# EasyEDA Pro project 复活吧！我们的平衡车！.eprj

# Schematic Schematic1
Board Name: Board1; Create Date: 2025-03-22; Page Name: P1; Project Name: 复活吧！我们的平衡车！; Schematic Name: Schematic1; Update Date: 2025-03-22; Company: 嘉立创EDA; Page Size: A4; Version: V1.0
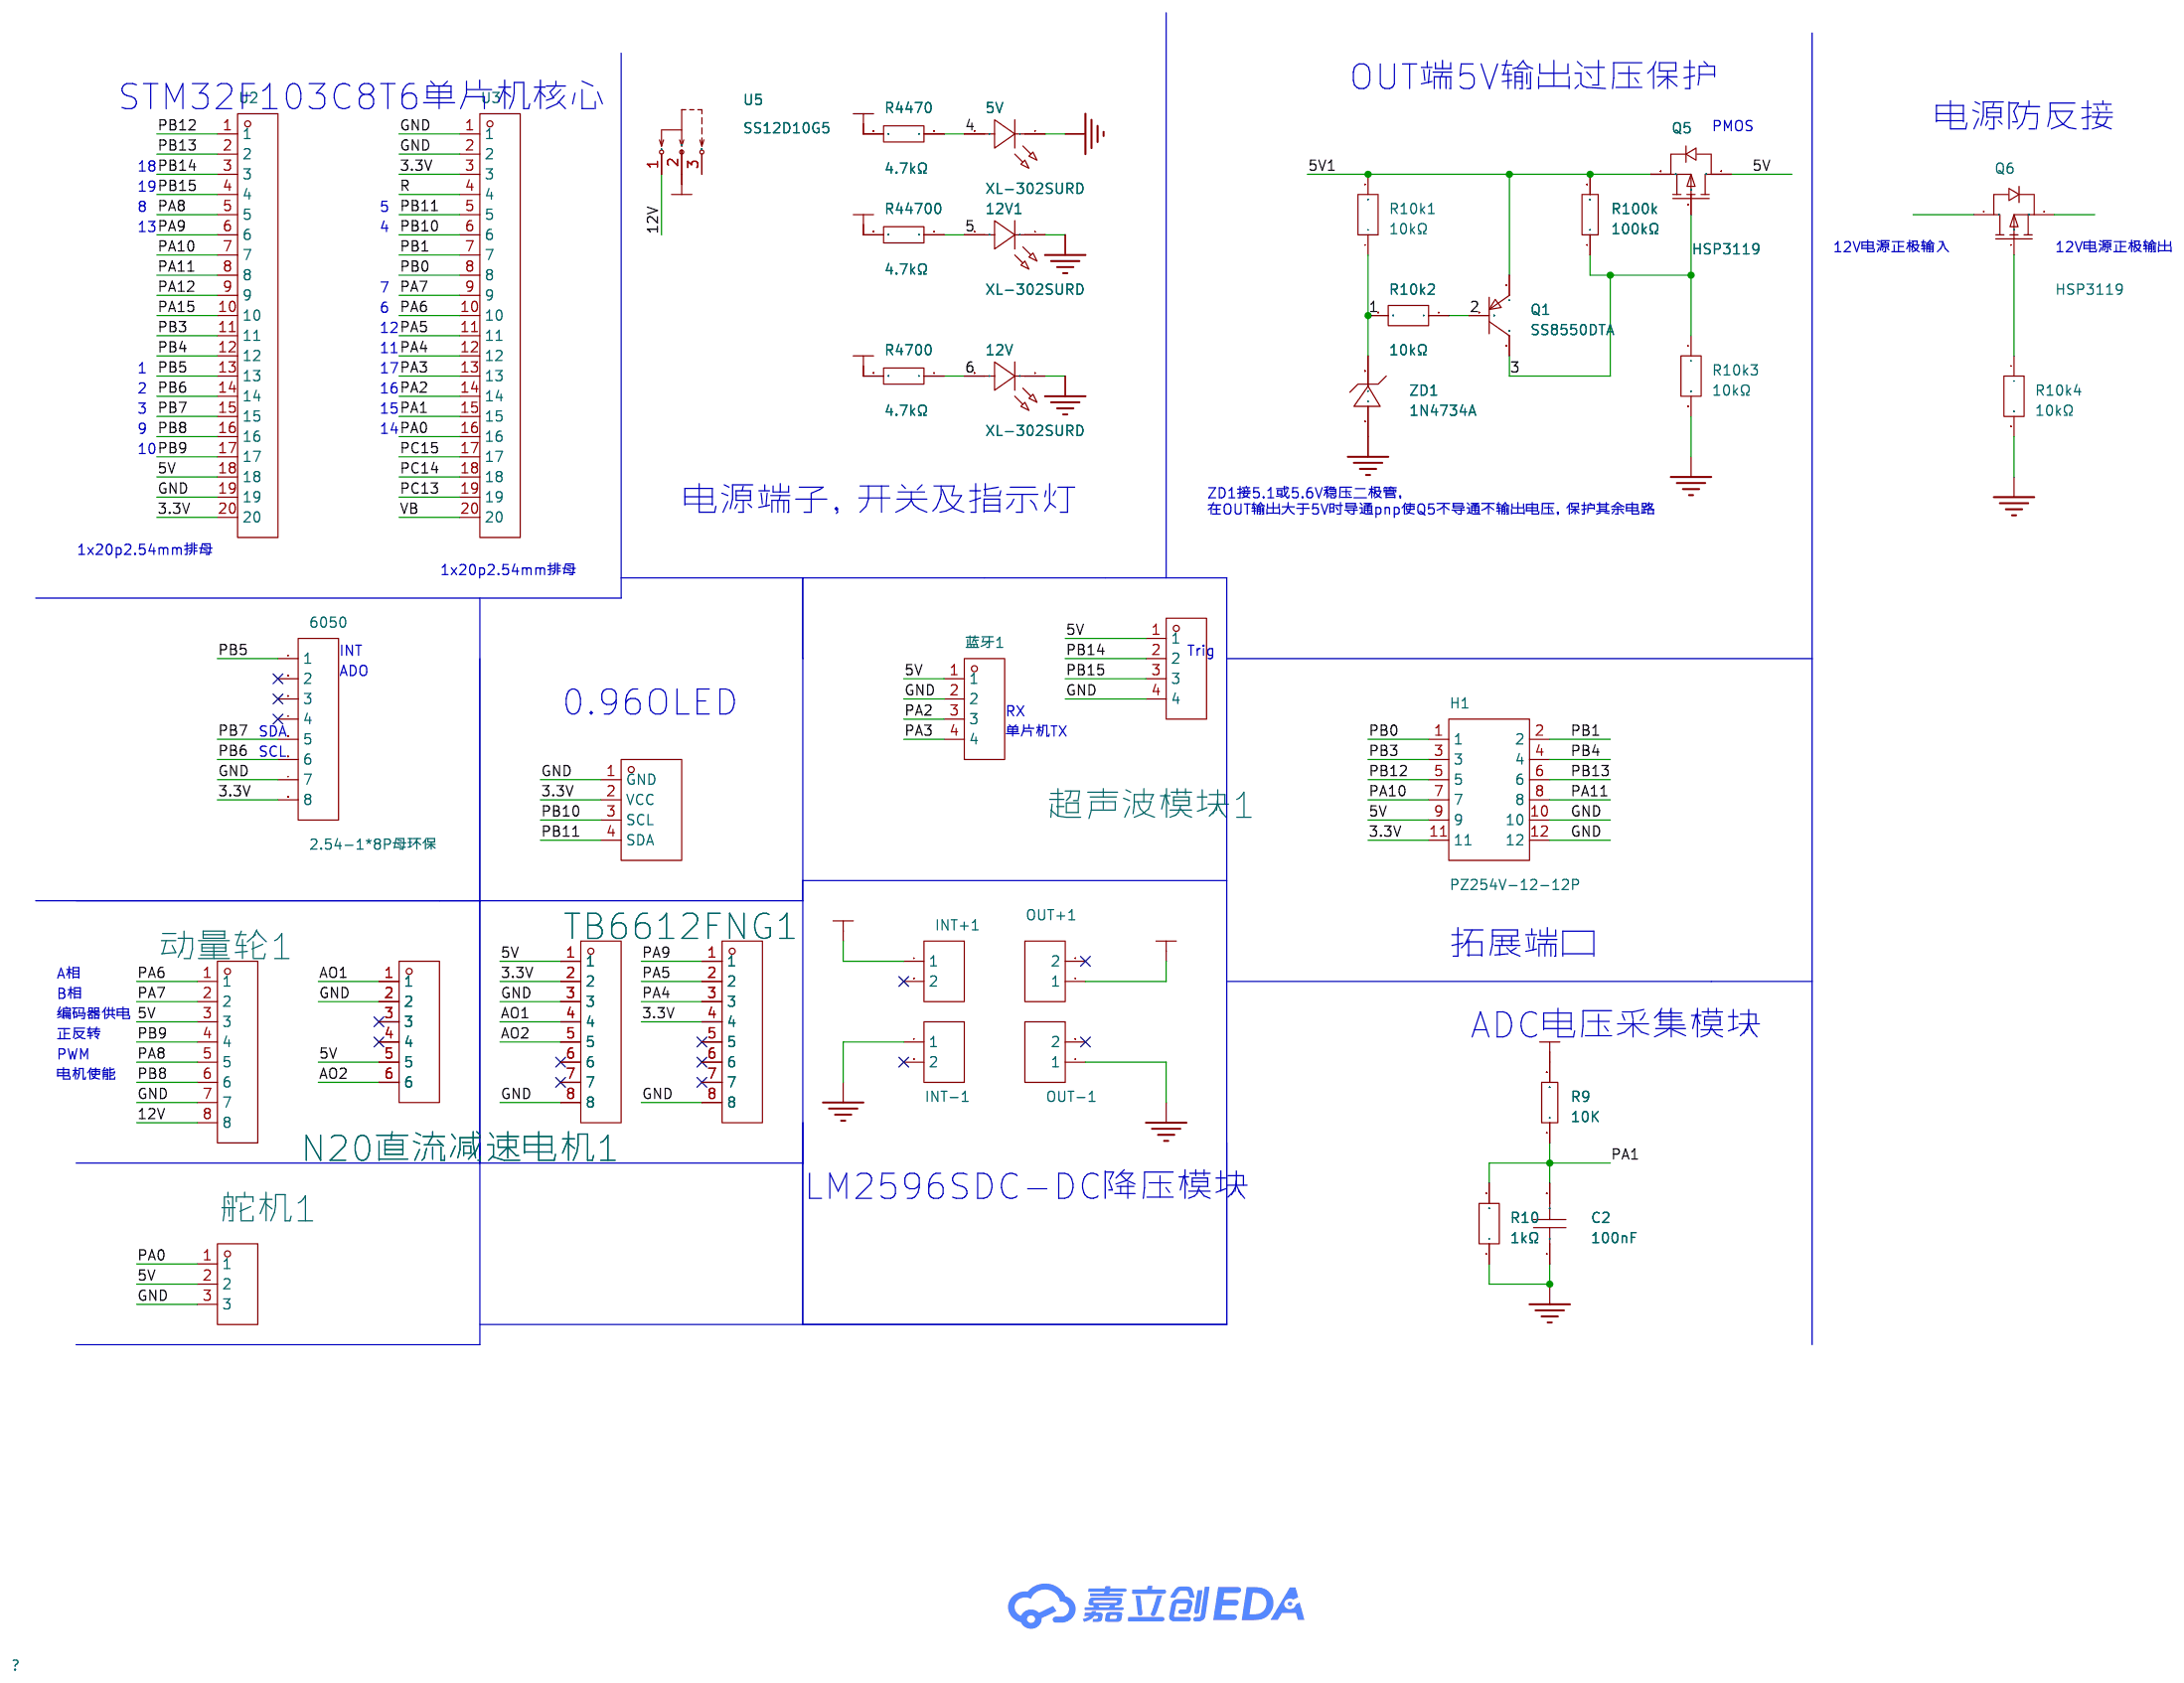
[diagram p0: schematic sheet]

## Parts
5V  XL-302SURD  [LED-TH_BD3.8-P2.54-RD]
12V  XL-302SURD  [LED-TH_BD3.8-P2.54-RD]
12V1  XL-302SURD  [LED-TH_BD3.8-P2.54-RD]
6050  2.54-1*8P母环保  [HDR-TH_8P-P2.54-V-F-1]
C2  100nF  [rad-0.1]
H1  PZ254V-12-12P  [HDR-TH_12P-P2.54-V-M-R2-C6-S2.54]
INT+1  2.54-1*2P母  [HDR-TH_2P-P2.54-V-F]
INT-1  2.54-1*2P母  [HDR-TH_2P-P2.54-V-F]
N20直流减速电机1  KH-2PH90-1X6P-L10.5  [hdr-th_6p-p2.54-v-f]
OLED1  HS96L03W2C03  [OLED-TH_L27.8-W27.2-P2.54_C9900033791]
OUT+1  2.54-1*2P母  [HDR-TH_2P-P2.54-V-F]
OUT-1  2.54-1*2P母  [HDR-TH_2P-P2.54-V-F]
Q1  SS8550DTA  [TO-92-3_L4.8-W3.7-P2.54-L]
Q5  HSP3119  [TO-220-3_L10.2-W4.5-P2.54-L-1]
Q6  HSP3119  [TO-220-3_L10.2-W4.5-P2.54-L-1]
R9  10K  [RES-TH_BD2.3-L6.5-P10.50-D0.5]
R10  1kΩ  [RES-TH_BD2.3-L6.5-P10.50-D0.5]
R10k1  10kΩ  [RES-TH_BD2.4-L6.3-P10.30-D0.6]
R10k2  10kΩ  [RES-TH_BD2.4-L6.3-P10.30-D0.6]
R10k3  10kΩ  [RES-TH_BD2.4-L6.3-P10.30-D0.6]
R10k4  10kΩ  [RES-TH_BD2.4-L6.3-P10.30-D0.6]
R100k  100kΩ  [RES-TH_BD2.7-L6.2-P10.20-D0.4]
R4470  4.7kΩ  [RES-TH_BD2.3-L6.5-P10.50-D0.5]
R4700  4.7kΩ  [RES-TH_BD2.3-L6.5-P10.50-D0.5]
R44700  4.7kΩ  [RES-TH_BD2.3-L6.5-P10.50-D0.5]
TB1  2.54-1*8P/30mm(3+24+3)  [hdr-th_8p-p2.54-v-f]
TB6612FNG1  2.54-1*8P/30mm(3+24+3)  [HDR-TH_8P-P2.54-V-M-4]
U2  KH-2FH-1X20P-H4.3  [hdr-th_20p-p2.54-v-f]
U3  KH-2FH-1X20P-H4.3  [hdr-th_20p-p2.54-v-f]
U5  SS12D10G5  [SW-TH_SHOU-HAN_SS12D10G4]
ZD1  1N4734A  [DO-41_BD2.8-L4.2-P8.00-D0.7-FD]
动量轮1  2.54-1*8P/30mm(3+24+3)  [hdr-th_8p-p2.54-v-f]
舵机1  PM254V-11-03-H85  [HDR-TH_3P-P2.54-V-F]
蓝牙1  2.54-1*4P母
超声波模块1  KH-2.54FH-1X4P-H8.5

## Library data of the parts
5V 12V 12V1 = XL-302SURD: 灯头类型:3mm圆形灯头;发光颜色:红色;功率:80mW;正向电流:30mA;主波长:615nm~620nm;透镜颜色:红色透镜;色温:-;发光角度:50°;载带方式:-;工作温度:-25℃~+85℃;; Supplier Part: C2895470; Manufacturer: XINGLIGHT(成兴光); Supplier Footprint: 插件,D=3mm; JLCPCB Part Class: 扩展库; Datasheet: https://atta.szlcsc.com/upload/public/pdf/source/20240112/E1E2B82945FD635E4907401DDE6D4922.pdf; Supplier: LCSC; Lamp Holder Type: 3mm圆形灯头; Emitted Color: 红色; Power Dissipation: 80mW; Forward Current: 30mA; Dominant Wavelength: 615nm~620nm; Peak Wavelength: 625nm; Lens Color: 红色透镜; Viewing Angle: 50°; Operating Temperature: -25℃~+85℃
6050 = 2.54-1*8P母环保: 插孔结构:1x8P;间距:2.54mm;行距:-;安装类型:直插;排数:单排;总孔位数:8P;塑高:-;触头材质:-;触头镀层:-;; LCSC Part Name: 间距:2.54mm 1x8P 直插; Supplier Part: C27438; Manufacturer: BOOMELE(博穆精密); Supplier Footprint: 插件,P=2.54mm; JLCPCB Part Class: 扩展库; Datasheet: https://atta.szlcsc.com/upload/public/pdf/source/20231221/1CA800C6799ED97958773716FAA1BFFE.pdf; Supplier: LCSC; Holes Structure: 1x8P; Pitch: 2.54mm; Mounting Type: 直插; Number of Rows: 单排; Number of Holes: 8P
C2 = CAP_0603: Supplier Footprint: 0603
H1 = PZ254V-12-12P: 插针结构:2x6P;间距:2.54mm;行距:2.54mm;圆针/方针:方针;安装方式:直插;排数:双排;总PIN位数:12P;额定电流:-;额定电压:-;配合针长度:6mm;塑高:2.5mm;端接针长度:3mm;触头材质:黄铜;触头镀层:-;工作温度:-40℃~+105℃;颜色:黑色;; LCSC Part Name: 2x6P 间距:2.54mm 方针 直插; Supplier Part: C492423; Manufacturer: XFCN(兴飞); Supplier Footprint: 插件,P=2.54mm; JLCPCB Part Class: 扩展库; Datasheet: https://atta.szlcsc.com/upload/public/pdf/source/20200309/C492423_E4E2C9BC0EB9D59A2ABE4377D2E234B2.pdf; Supplier: LCSC; Pin Structure: 2x6P; Pitch: 2.54mm; Row Spacing: 2.54mm; Circluar Pins/Square Pins: 方针; Mounting Type: 直插; Number of Rows: 双排; Number of Pins: 12P; Length of Mating Pin: 6mm; Insulation Height: 2.5mm; Length of End Connection Pin: 3mm; Contact Material: 黄铜; Operating Temperature: -40℃~+105℃; Color: 黑色
INT+1 INT-1 OUT+1 OUT-1 = 2.54-1*2P母: 插孔结构:1x2P;间距:2.54mm;行距:-;安装类型:直插;排数:单排;总孔位数:2P;塑高:-;触头材质:-;触头镀层:-;; LCSC Part Name: 间距:2.54mm 1x2P 直插; Supplier Part: C49661; Manufacturer: BOOMELE(博穆精密); Supplier Footprint: 插件,P=2.54mm; JLCPCB Part Class: 扩展库; Datasheet: https://atta.szlcsc.com/upload/public/pdf/source/20210301/C2718488_F4427B881E42CAA8DDB0B1C12B3A522C.pdf; Supplier: LCSC; Holes Structure: 1x2P; Pitch: 2.54mm; Mounting Type: 直插; Number of Rows: 单排; Number of Holes: 2P
N20直流减速电机1 = KH-2PH90-1X6P-L10.5: 插针结构:1x6P;间距:2mm;行距:-;圆针/方针:方针;安装类型:弯插;排数:单排;总PIN位数:6P;额定电流:1.5A;额定电压:-;配合针长度:4mm;塑高:2mm;端接针长度:-;工作温度范围:-40℃~+105℃;颜色:-;; LCSC Part Name: 间距:2mm 1x6P 弯插 方针; Supplier Part: C2938467; Manufacturer: kinghelm(金航标); Supplier Footprint: 弯插,P=2mm; JLCPCB Part Class: 扩展库; Datasheet: https://atta.szlcsc.com/upload/public/pdf/source/20211228/823CD8A7BB037D772766BAFF43582E23.pdf; Supplier: LCSC; Pin Structure: 1x6P; Pitch: 2mm; Circluar Pins/Square Pins: 方针; Mounting Type: 弯插; Number of Rows: 单排; Number of Pins: 6P; Current Rating (Max): 1.5A; Length of Mating Pin: 4mm; Insulation Height: 2mm; Operating Temperature Range: -40℃~+105℃
OLED1 = HS96L03W2C03: 主控芯片:SSD1315;接口类型:I2C;尺寸(inch):0.96;像素分辨率:128x64;; LCSC Part Name: 0.96寸OLED显示屏窄白光IIC; Supplier Part: C5248080; Manufacturer: HS(汉昇); JLCPCB Part Class: 扩展库; Datasheet: https://atta.szlcsc.com/upload/public/pdf/source/20230627/763D01F79A90007632F098068C7C8AD9.pdf; Supplier: LCSC; Main Control Chip: SSD1315; Interface Type: I2C; Size: 0.96; Pixel Resolution: 128x64; Operating Temperature: -40℃~+70℃
Q1 = SS8550DTA: 晶体管类型:PNP;集电极电流(Ic):1.5A;集射极击穿电压(Vceo):25V;功率(Pd):2W;直流电流增益(hFE@Ic,Vce):40@800mA,1V;; LCSC Part Name: PNP 电流:1.5A 耐压:25V; Supplier Part: C903228; Manufacturer: onsemi(安森美); Supplier Footprint: TO-92-3; JLCPCB Part Class: Extended Part; Datasheet: https://atta.szlcsc.com/upload/public/pdf/source/20221020/9DBCD1C6A257D06DE4F9043ED0140297.pdf; Supplier: LCSC; Transistor Type: PNP; Collector Current (Ic): 1.5A; Collector-Emitter Breakdown Voltage (Vceo): 25V; Power Dissipation (Pd): 2W; DC Current Gain (hFE@Ic,Vce): 40@800mA,1V; Transition Frequency (fT): 100MHz; Collector Cut-Off Current (Icbo): 100nA; Collector-Emitter Saturation Voltage (VCE(sat)@Ic,Ib): 280mV@800mA,80mA; Operating Temperature: -65℃~+150℃
Q5 Q6 = HSP3119: 类型:1个P沟道;漏源电压(Vdss):30V;连续漏极电流(Id):150A;导通电阻(RDS(on)):-;耗散功率(Pd):200W;阈值电压(Vgs(th)):2.5V;; LCSC Part Name: 1个P沟道 耐压:30V 电流:150A; Supplier Part: C22359262; Manufacturer: HUASHUO(华朔); Supplier Footprint: TO-220; JLCPCB Part Class: Extended Part; Datasheet: https://atta.szlcsc.com/upload/public/pdf/source/20240313/B2043F85A28365E5AF5F107A9C9B0F2E.pdf; Supplier: LCSC; Type: 1个P沟道; Drain to Source Voltage: 30V; Current - Continuous Drain(Id): 150A; Pd - Power Dissipation: 200W; Gate Threshold Voltage (Vgs(th)@Id): 2.5V; Input Capacitance(Ciss@Vds): 12.7nF@15V; Reverse Transfer Capacitance (Crss@Vds): 1.21nF@15V; Operating Temperature: -55℃~+150℃@(Tj)
R9 = Res_0603: Supplier Footprint: 0603
R10 = MF1/4W-1KΩ±1%T52: 电阻类型:金属膜电阻;阻值:1kΩ;精度:±1%;功率:250mW;温度系数:±200ppm/℃;; LCSC Part Name: 金属膜电阻 1kΩ ±1% 250mW; Supplier Part: C713997; Manufacturer: 华星机电; Supplier Footprint: 插件; JLCPCB Part Class: 扩展库; Datasheet: https://atta.szlcsc.com/upload/public/pdf/source/20200731/C713882_AE8EB1102749D7E4FB4FB13DC898C429.pdf; Supplier: LCSC; Type: 金属膜电阻; Tolerance: ±1%; Power(Watts): 250mW; Temperature Coefficient: ±200ppm/℃
R10k1-R10k4 = RN1/4W10KFT/BA1: 电阻类型:金属膜电阻;阻值:10kΩ;精度:±1%;功率:250mW;温度系数:±50ppm/℃;; LCSC Part Name: 10kΩ ±1% 250mW 金属膜电阻; Supplier Part: C410695; Manufacturer: Tyohm(幸亚电阻); Supplier Footprint: 插件,D2.4xL6.5mm; JLCPCB Part Class: Extended Part; Datasheet: https://atta.szlcsc.com/upload/public/pdf/source/20190808/C410699_D126E64D28B638F1D73B58E9F61DFD9B.pdf; Supplier: LCSC; Type: 金属膜电阻; Tolerance: ±1%; Overload Voltage (Max): 250V; Power(Watts): 250mW; Temperature Coefficient: ±50ppm/℃; Operating Temperature Range: -55℃~+125℃
R100k = MF1/4W-100K±1%-OT26: 电阻类型:金属膜电阻;阻值:100kΩ;精度:±1%;功率:250mW;温度系数:±350ppm/℃;; LCSC Part Name: 金属膜电阻 100kΩ ±1% 250mW; Supplier Part: C2843019; Manufacturer: VO(翔胜); Supplier Footprint: 插件,D2.7xL6.2mm; JLCPCB Part Class: Extended Part; Datasheet: https://atta.szlcsc.com/upload/public/pdf/source/20200609/C601728_5AA4C0C8E12E11069DA2C3356F29D1F2.pdf; Supplier: LCSC; Type: 金属膜电阻; Tolerance: ±1%; Overload Voltage (Max): 250V; Power(Watts): 250mW; Temperature Coefficient: ±350ppm/℃; Operating Temperature Range: -55℃~+155℃
R4470 R4700 R44700 = 0402WGF4701TCE: 电阻类型:厚膜电阻;阻值:4.7kΩ;精度:±1%;功率:62.5mW;最大工作电压:50V;温度系数:±100ppm/℃;; LCSC Part Name: 4.7kΩ ±1% 62.5mW 厚膜电阻; Supplier Part: C25900; Manufacturer: UNI-ROYAL(厚声); Supplier Footprint: 0402; JLCPCB Part Class: 基础库; Datasheet: https://atta.szlcsc.com/upload/public/pdf/source/20200306/C422600_1E6D84923E4A46A82E41ADD87F860B5C.pdf; Supplier: LCSC; Type: 厚膜电阻; Tolerance: ±1%; Power(Watts): 62.5mW; Overload Voltage (Max): 50V; Temperature Coefficient: ±100ppm/℃; Operating Temperature Range: -55℃~+155℃
TB1 TB6612FNG1 动量轮1 = 2.54-1*8P/30mm(3+24+3): Supplier Part: C9900034496; Supplier Footprint: 2.54-1x8; JLCPCB Part Class: 扩展库; Supplier: LCSC
U2 U3 = KH-2FH-1X20P-H4.3: 插孔结构:1x20P;间距:2mm;行距:-;圆孔/方孔:方孔;安装类型:直插;排数:单排;总孔位数:20P;额定电流:1.5A;额定电压:-;插孔方向:顶部;塑高:4.3mm;工作温度范围:-40℃~+105℃;; LCSC Part Name: 间距:2mm 1x20P 直插; Supplier Part: C2938439; Manufacturer: kinghelm(金航标); Supplier Footprint: 插件,P=2mm; JLCPCB Part Class: 扩展库; Datasheet: https://atta.szlcsc.com/upload/public/pdf/source/20211228/5EC70B7FC510D3D80A3799409C3607F1.pdf; Supplier: LCSC; Holes Structure: 1x20P; Pitch: 2mm; Circular Hole / Square Hole: 方孔; Mounting Type: 直插; Number of Rows: 单排; Number of Holes: 20P; Current Rating (Max): 1.5A; Holes Direction: 顶部; Insulation Height: 4.3mm; Operating Temperature Range: -40℃~+105℃
U5 = SS12D10G5: 电路结构:单刀双掷;安装方式:直插;额定电流(DC):2A;额定电压(DC):125V;机械寿命:3千次;; LCSC Part Name: 两档立式插件 3脚拨动开关 柄长5.0mm; Supplier Part: C7431054; Manufacturer: SHOU HAN(首韩); Supplier Footprint: 插件; JLCPCB Part Class: 扩展库; Datasheet: https://atta.szlcsc.com/upload/public/pdf/source/20231130/7A3DB6A149BF0A1DCFFE64FFC07FE434.pdf; Supplier: LCSC; Circuit: 单刀双掷; Switch Length: 12.7mm; Switch Width: 6.7mm; Mounting Style: 直插; Current Rating (DC): 2A; Voltage Rating (DC): 125V; Mechanical Life: 3千次; Operating Temperature: -25℃~+70℃
ZD1 = 1N4734A_C41430: 二极管配置:独立式;稳压值(标称值):5.6V;耗散功率(Pd):-;; LCSC Part Name: 编带 1N4734A; Supplier Part: C41430; Manufacturer: ST(先科); Supplier Footprint: DO-41; JLCPCB Part Class: Extended Part; Datasheet: https://atta.szlcsc.com/upload/public/pdf/source/20170719/C118641_1500457766301828347.pdf; Supplier: LCSC; Diode Configuration: 独立式; Zener Voltage(Nom): 5.6V; Reverse Leakage Current (Ir): 10uA@2V; Impedance(Zzt): 5Ω
舵机1 = PM254V-11-03-H85: 插孔结构:1x3P;间距:2.54mm;行距:-;安装类型:直插;排数:单排;总孔位数:3P;塑高:-;触头材质:黄铜;触头镀层:-;; LCSC Part Name: 间距:2.54mm 1x3P 直插; Supplier Part: C541850; Manufacturer: XFCN(兴飞); Supplier Footprint: 插件,P=2.54mm; JLCPCB Part Class: 扩展库; Datasheet: https://atta.szlcsc.com/upload/public/pdf/source/20200518/C541849_85853D71FC67C51915A806977A588FDA.pdf; Supplier: LCSC; Holes Structure: 1x3P; Pitch: 2.54mm; Mounting Type: 直插; Number of Rows: 单排; Number of Holes: 3P; Contact Material: 黄铜
蓝牙1 = 2.54-1*4P母: 插孔结构:1x4P;间距:2.54mm;行距:-;圆孔/方孔:方孔;安装类型:直插;排数:单排;总孔位数:4P;额定电流:3A;额定电压:-;插孔方向:顶部;塑高:-;触头材质:青铜;触头镀层:-;工作温度范围:-40℃~+105℃;焊接温度(最大值):-;; LCSC Part Name: 间距:2.54mm 1x4P 直插; Supplier Part: C2718488; Manufacturer: BOOMELE(博穆精密); Supplier Footprint: 插件,P=2.54mm; JLCPCB Part Class: 扩展库; Datasheet: https://atta.szlcsc.com/upload/public/pdf/source/20210301/C2718488_F4427B881E42CAA8DDB0B1C12B3A522C.pdf; Supplier: LCSC; Holes Structure: 1x4P; Pitch: 2.54mm; Circular Hole / Square Hole: 方孔; Mounting Type: 直插; Number of Rows: 单排; Number of Holes: 4P; Current Rating (Max): 3A; Holes Direction: 顶部; Contact Material: 青铜; Operating Temperature Range: -40℃~+105℃
超声波模块1 = KH-2.54FH-1X4P-H8.5: 插孔结构:1x4P;间距:2.54mm;行距:-;圆孔/方孔:方孔;安装类型:直插;排数:单排;总孔位数:4P;额定电流:3A;额定电压:-;插孔方向:顶部;塑高:8.5mm;工作温度范围:-40℃~+105℃;; LCSC Part Name: 间距:2.54mm 1x4P 直插; Supplier Part: C2905415; Manufacturer: kinghelm(金航标); Supplier Footprint: 插件,P=2.54mm; JLCPCB Part Class: 扩展库; Datasheet: https://atta.szlcsc.com/upload/public/pdf/source/20211019/F01742C8B89DCA4810A857CC894DA6D1.pdf; Supplier: LCSC; Holes Structure: 1x4P; Pitch: 2.54mm; Circular Hole / Square Hole: 方孔; Mounting Type: 直插; Number of Rows: 单排; Number of Holes: 4P; Current Rating (Max): 3A; Holes Direction: 顶部; Insulation Height: 8.5mm; Operating Temperature Range: -40℃~+105℃

## Nets
3.3V: 6050.8 H1.11 OLED1.2(VCC) TB1.4 TB6612FNG1.2 U2.20 U3.3
5V: H1.9 N20直流减速电机1.5 Q5.2(D) R4470.2 TB6612FNG1.1 U2.18 动量轮1.3 舵机1.2 蓝牙1.1 超声波模块1.1
5V1: OUT+1.1 Q1.1(E) Q5.3(S) R10k1.2 R100k.2
12V: INT+1.1 R9.2 R4700.2 U5.1 动量轮1.8
12V1: R44700.2 U5.2
GND: 5V.1(K) 12V.1(K) 12V1.1(K) 6050.7 C2.1 H1.10 H1.12 INT-1.1 N20直流减速电机1.2 OLED1.1(GND) OUT-1.1 R10.1 R10k3.2 R10k4.2 TB1.8 TB6612FNG1.3 TB6612FNG1.8 U2.19 U3.1 U3.2 ZD1.1(A) 动量轮1.7 舵机1.3 蓝牙1.2 超声波模块1.4
1: R10k1.1 R10k2.2 ZD1.2(K)
2: Q1.2(B) R10k2.1
3: Q1.3(C) Q5.1(G) R10k3.1 R100k.1
4: 5V.2(A) R4470.1
5: 12V1.2(A) R44700.1
6: 12V.2(A) R4700.1
AO1: N20直流减速电机1.1 TB6612FNG1.4
AO2: N20直流减速电机1.6 TB6612FNG1.5
PA0: U3.16 舵机1.1
PA1: C2.2 R9.1 R10.2 U3.15
PA2: U3.14 蓝牙1.3
PA3: U3.13 蓝牙1.4
PA4: TB1.3 U3.12
PA5: TB1.2 U3.11
PA6: U3.10 动量轮1.1
PA7: U3.9 动量轮1.2
PA8: U2.5 动量轮1.5
PA9: TB1.1 U2.6
PA10: H1.7 U2.7
PA11: H1.8 U2.8
PA12: U2.9
PA15: U2.10
PB0: H1.1 U3.8
PB1: H1.2 U3.7
PB3: H1.3 U2.11
PB4: H1.4 U2.12
PB5: 6050.1 U2.13
PB6: 6050.6 U2.14
PB7: 6050.5 U2.15
PB8: U2.16 动量轮1.6
PB9: U2.17 动量轮1.4
PB10: OLED1.3(SCL) U3.6
PB11: OLED1.4(SDA) U3.5
PB12: H1.5 U2.1
PB13: H1.6 U2.2
PB14: U2.3 超声波模块1.2
PB15: U2.4 超声波模块1.3
PC13: U3.19
PC14: U3.18
PC15: U3.17
R: U3.4
VB: U3.20
Net-(Q6-1): Q6.1(G) R10k4.1

Not connected (* = marked no-connect by the designer): 6050 2* 3* 4*; INT+1 2*; INT-1 2*; N20直流减速电机1 3* 4*; OUT+1 2*; OUT-1 2*; Q6 2(D) 3(S); TB1 5* 6* 7*; TB6612FNG1 6* 7*; U5 3

## Notes on the sheet
- OUT端5V输出过压保护
- STM32F103C8T6单片机核心
- PMOS
- 电源防反接
- 18
- 19
- 8
- 5
- 13
- 4
- 12V电源正极输入
- 12V电源正极输出
- 7
- 6
- 11
- 12
- 1
- 17
- 2
- 16
- 3
- 15
- 9
- 14
- 10
- 电源端子，开关及指示灯
- ZD1接5.1或5.6V稳压二极管，
  在OUT输出大于5V时导通pnp使Q5不导通不输出电压，保护其余电路
- 1x20p2.54mm排母
- 1x20p2.54mm排母
- INT
- Trig
- ADO
- SDA
- 0.96OLED
- RX
- 单片机TX
- SCL
- 拓展端口
- A相
- B相
- 编码器供电
- 正反转
- ADC电压采集模块
- PWM
- 电机使能
- LM2596SDC-DC降压模块

# Board PCB1
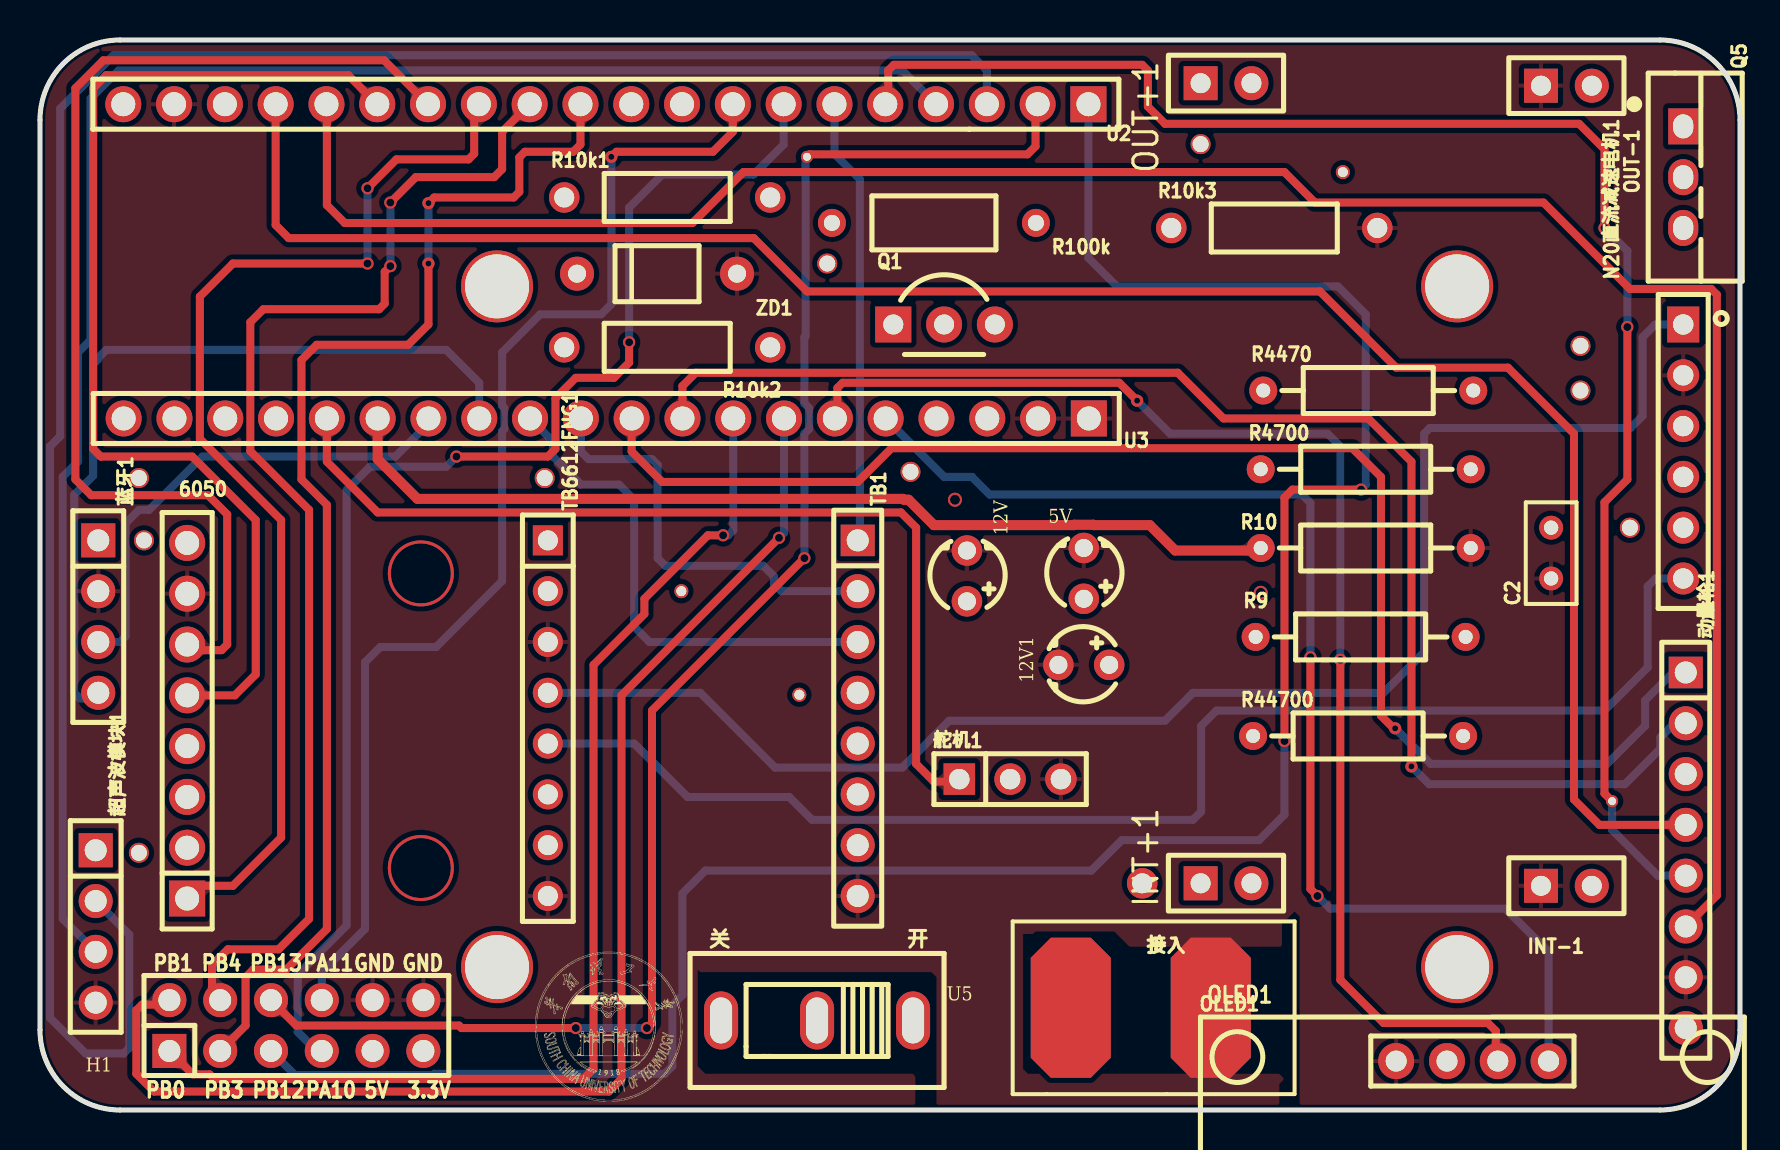
[diagram p1: board, top side]
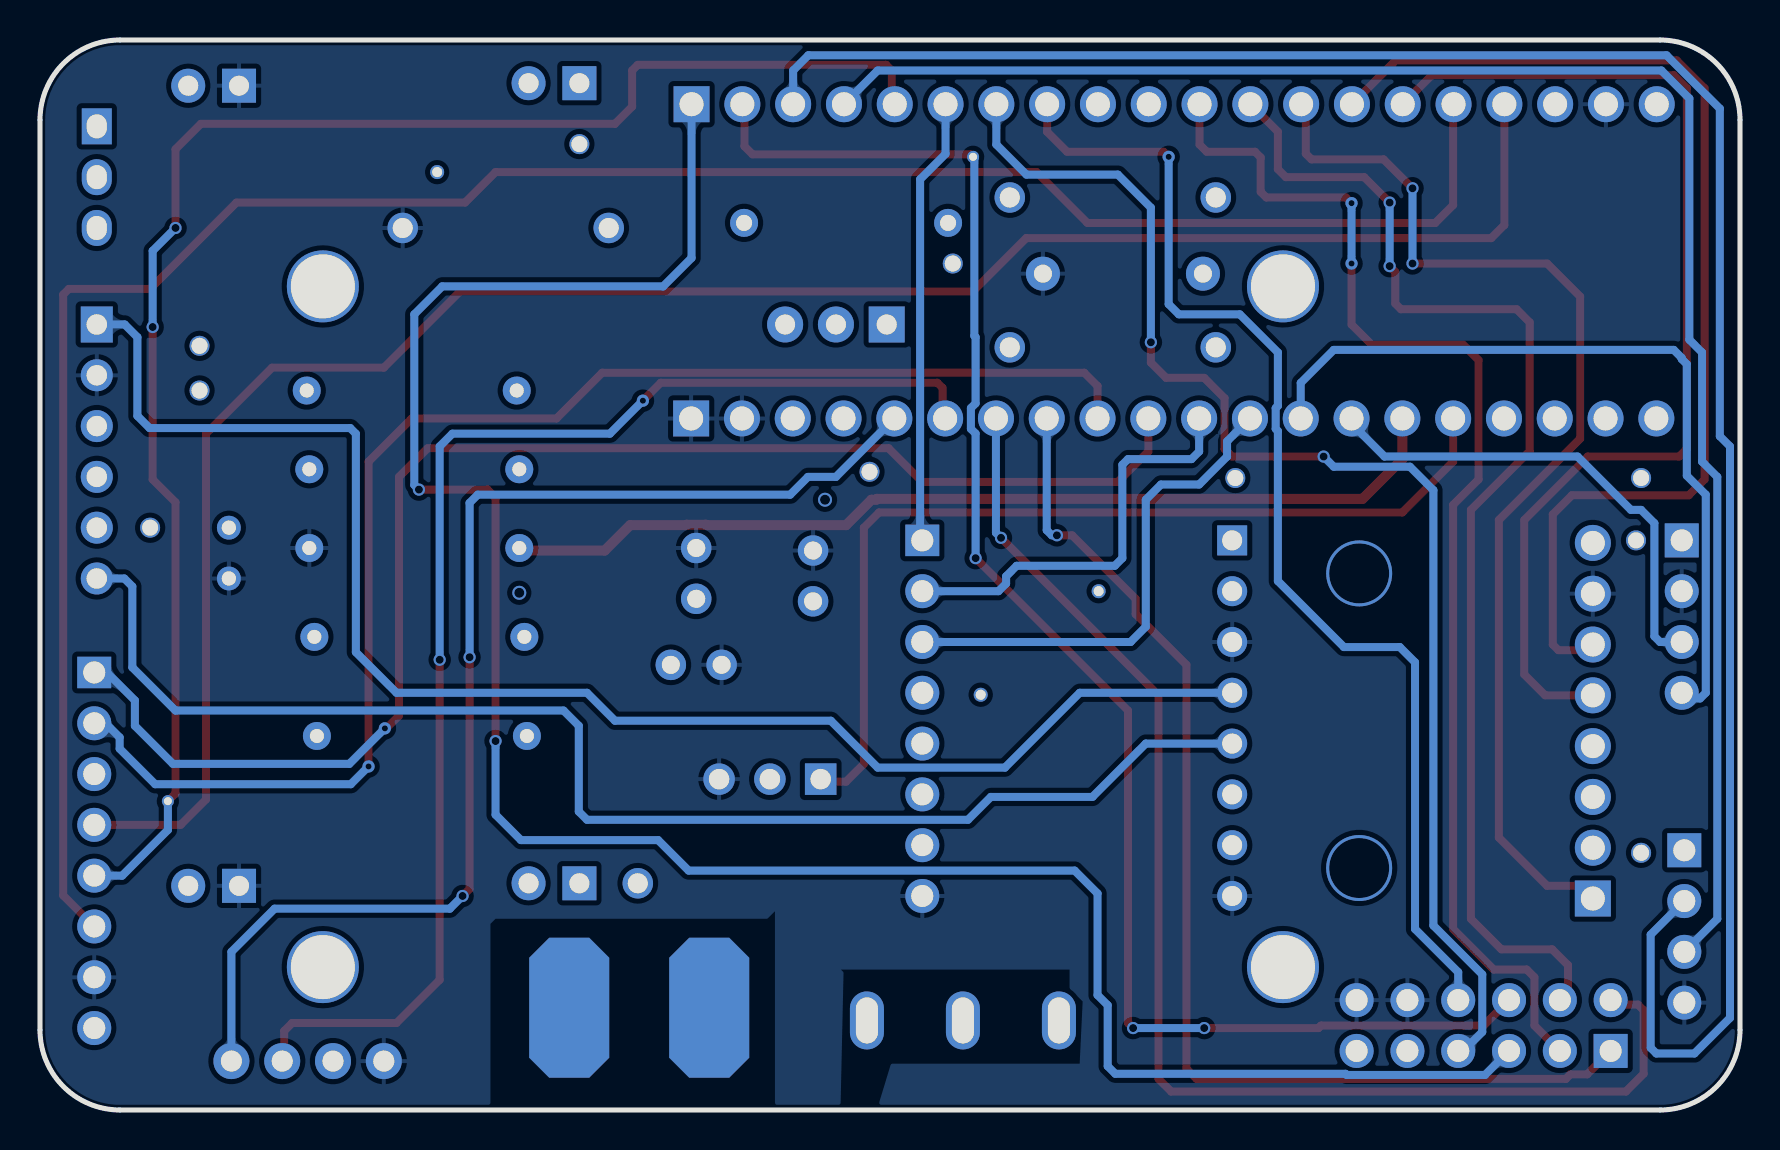
[diagram p2: board, bottom side, seen from below]

Outline 85 x 53.5 mm; copper layers: Top Layer, Inner1, Inner2, Bottom Layer. Coordinates in mm from the lower left corner of the outline.
Outline path: 0,49.5 0,4 arc(1.17,1.17) 4,0 81,0 arc(83.83,1.17) 85,4 85,49.5 arc(83.83,52.33) 81,53.5 4,53.5 arc(1.17,52.33) 0,49.5
Stack: Top Layer 0.035mm 外层铜厚1oz / Dielectric1 0.2104mm 7628 RC49% 8.6mil / Inner1 0.0152mm 内层铜厚 / Dielectric2 1.065mm 1.1mm H/HOZ Copper / Inner2 0.0152mm 内层铜厚 / Dielectric3 0.2104mm 7628 RC49% 8.6mil / Bottom Layer 0.035mm 外层铜厚1oz

## Design rules (mm)
template: 自定义配置
spacing copperThickness1oz (default): track to track 0.102, other pairs 0.152 to 0.3
spacing copperThickness2oz: track to track 0.203, other pairs 0.152 to 0.3
track width copperThickness1oz (default): min 0.4, default 0.4, max 1.5
track width copperThickness2oz: min 0.203, default 0.254, max 2.54
differential pair differentialPair (default): width min 0.127, default 0.254, max 2.54; gap min 0.152, default 0.152
via viaSize (default): diameter min 0.5, default 0.61, max 10; hole min 0.3, default 0.305, max 6.3

## Placement (name value [footprint] x y rotation side)
5V  XL-302SURD  [LED-TH_BD3.8-P2.54-RD]  52.19 26.83 270 top
12V  XL-302SURD  [LED-TH_BD3.8-P2.54-RD]  46.35 26.7 270 top
12V1  XL-302SURD  [LED-TH_BD3.8-P2.54-RD]  52.19 22.26 0 top
6050  2.54-1*8P母环保  [HDR-TH_8P-P2.54-V-F-1]  7.36 19.46 90 top
C2  100nF  [rad-0.1]  75.56 27.85 90 top
H1  PZ254V-12-12P  [HDR-TH_12P-P2.54-V-M-R2-C6-S2.54]  12.82 4.22 0 top
INT+1  2.54-1*2P母  [HDR-TH_2P-P2.54-V-F]  59.3 11.34 0 top
INT-1  2.54-1*2P母  [HDR-TH_2P-P2.54-V-F]  76.32 11.21 0 top
N20直流减速电机1  KH-2PH90-1X6P-L10.5  [hdr-th_6p-p2.54-v-f]  82.16 32.93 270 top
NOREF  -  [Pad_e33]  22.85 41.18 0 top
NOREF#2  -  [Pad_e325]  58.03 48.29 0 top
NOREF#3  -  [Pad_e766]  65.14 46.9 0 top
NOREF#4  -  [Pad_e1902]  38.35 47.66 0 top
NOREF#5  -  [Pad_e389]  4.94 12.86 0 top
NOREF#6  -  [Pad_e388]  25.24 31.6 0 top
NOREF#7  -  [Pad_e410]  4.94 31.6 0 top
NOREF#8  -  [Pad_e625]  37.97 20.76 0 top
NOREF#9  -  [Pad_e343]  77.02 35.97 0 top
NOREF#10  -  [Pad_e502]  79.49 29.12 0 top
NOREF#11  -  [Pad_e344]  77.02 38.21 0 top
NOREF#12  -  [Pad_e492]  43.52 31.91 0 top
NOREF#13  -  [Pad_e35]  70.86 7.14 0 top
NOREF#14  -  [Pad_e307]  39.36 42.32 0 top
NOREF#15  -  [Pad_e32]  22.85 7.14 0 top
NOREF#16  -  [Pad_e176]  55.11 11.34 0 top
NOREF#17  -  [Pad_e1487]  78.6 15.44 0 top
NOREF#18  -  [Pad_e390]  5.2 28.48 0 top
NOREF#19  -  [Pad_e34]  70.86 41.18 0 top
NOREF#20  -  [Pad_e604]  32.07 25.94 0 top
OLED1  HS96L03W2C03  [OLED-TH_L27.8-W27.2-P2.54_C9900033791]  71.62 2.45 0 top
OUT+1  2.54-1*2P母  [HDR-TH_2P-P2.54-V-F]  59.3 51.34 0 top
OUT-1  2.54-1*2P母  [HDR-TH_2P-P2.54-V-F]  76.32 51.21 0 top
Q1  SS8550DTA  [TO-92-3_L4.8-W3.7-P2.54-L]  45.2 39.28 0 top
Q5  HSP3119  [TO-220-3_L10.2-W4.5-P2.54-L-1]  82.16 46.64 270 top
R9  10K  [RES-TH_BD2.3-L6.5-P10.50-D0.5]  66.03 23.66 0 top
R10  1kΩ  [RES-TH_BD2.3-L6.5-P10.50-D0.5]  66.29 28.1 180 top
R10k1  10kΩ  [RES-TH_BD2.4-L6.3-P10.30-D0.6]  31.36 45.63 0 top
R10k2  10kΩ  [RES-TH_BD2.4-L6.3-P10.30-D0.6]  31.36 38.13 180 top
R10k3  10kΩ  [RES-TH_BD2.4-L6.3-P10.30-D0.6]  61.71 44.1 0 top
R100k  100kΩ  [RES-TH_BD2.7-L6.2-P10.20-D0.4]  44.7 44.36 180 top
R4470  4.7kΩ  [RES-TH_BD2.3-L6.5-P10.50-D0.5]  66.41 35.97 0 top
R4700  4.7kΩ  [RES-TH_BD2.3-L6.5-P10.50-D0.5]  66.29 32.04 0 top
R44700  4.7kΩ  [RES-TH_BD2.3-L6.5-P10.50-D0.5]  65.91 18.7 0 top
TB1  2.54-1*8P/30mm(3+24+3)  [hdr-th_8p-p2.54-v-f]  40.89 19.59 270 top
TB6612FNG1  2.54-1*8P/30mm(3+24+3)  [HDR-TH_8P-P2.54-V-M-4]  25.39 19.59 270 top
U2  KH-2FH-1X20P-H4.3  [hdr-th_20p-p2.54-v-f]  28.29 50.29 180 top
U3  KH-2FH-1X20P-H4.3  [hdr-th_20p-p2.54-v-f]  28.31 34.58 180 top
U5  SS12D10G5  [SW-TH_SHOU-HAN_SS12D10G4]  38.85 4.48 180 top
ZD1  1N4734A  [DO-41_BD2.8-L4.2-P8.00-D0.7-FD]  30.85 41.82 180 top
动量轮1  2.54-1*8P/30mm(3+24+3)  [hdr-th_8p-p2.54-v-f]  82.29 12.99 270 top
接入  Header 2  [T接头]  58.54 5.11 270 top
舵机1  PM254V-11-03-H85  [HDR-TH_3P-P2.54-V-F]  48.51 16.54 0 top
蓝牙1  2.54-1*4P母  [HDR-TH_4P-P2.54-V-F]  2.91 24.67 270 top
超声波模块1  KH-2.54FH-1X4P-H8.5  [HDR-TH_4P-P2.54-V-F]  2.79 9.18 270 top

## Footprints (pads in the part's own frame, mm; a bottom-side part is the same pattern mirrored in y, then rotated)
DO-41_BD2.8-L4.2-P8.00-D0.7-FD
  round 1.7 hole 0.9: 1(-4,0) 2(4,0)
HDR-TH_2P-P2.54-V-F
  rect 1.7x1.7 hole 1: 1(-1.27,0)
  round 1.7 hole 1: 2(1.27,0)
HDR-TH_3P-P2.54-V-F
  rect 1.575x1.575 hole 1.02: 1(-2.54,0)
  round 1.575 hole 1.02: 2(0,0) 3(2.54,0)
HDR-TH_4P-P2.54-V-F
  rect 1.7x1.7 hole 1.1: 1(-3.81,0)
  round 1.7 hole 1.1: 2(-1.27,0) 3(1.27,0) 4(3.81,0)
hdr-th_6p-p2.54-v-f
  rect 1.8x1.6 hole 1.02: 1(-6.35,0)
  round 1.6 hole 1.02: 2(-3.81,0) 3(-1.27,0) 4(1.27,0) 5(3.81,0) 6(6.35,0)
hdr-th_8p-p2.54-v-f
  rect 1.575x1.7 hole 1.1: 1(-8.89,0)
  round 1.7 hole 1.1: 2(-6.35,0) 3(-3.81,0) 4(-1.27,0) 5(1.27,0) 6(3.81,0) 7(6.35,0) 8(8.89,0)
HDR-TH_8P-P2.54-V-F-1
  rect 1.8x1.8 hole 1.2: 1(-8.89,0)
  round 1.8 hole 1.2: 2(-6.35,0) 3(-3.81,0) 4(-1.27,0) 5(1.27,0) 6(3.81,0) 7(6.35,0) 8(8.89,0)
HDR-TH_8P-P2.54-V-M-4
  rect 1.5x1.5 hole 1: 1(-8.89,0)
  round 1.5 hole 1: 2(-6.35,0) 3(-3.81,0) 4(-1.27,0) 5(1.27,0) 6(3.81,0) 7(6.35,0) 8(8.89,0)
HDR-TH_12P-P2.54-V-M-R2-C6-S2.54
  rect 1.7x1.7 hole 1.1: 1(-6.35,-1.27)
  round 1.7 hole 1.1: 2(-6.35,1.27) 3(-3.81,-1.27) 4(-3.81,1.27) 5(-1.27,-1.27) 6(-1.27,1.27) 7(1.27,-1.27) 8(1.27,1.27) 9(3.81,-1.27) 10(3.81,1.27) 11(6.35,-1.27) 12(6.35,1.27)
hdr-th_20p-p2.54-v-f
  rect 1.8x1.8 hole 1.2: 1(-24.13,0)
  round 1.8 hole 1.2: 2(-21.59,0) 3(-19.05,0) 4(-16.51,0) 5(-13.97,0) 6(-11.43,0) 7(-8.89,0) 8(-6.35,0) 9(-3.81,0) 10(-1.27,0) 11(1.27,0) 12(3.81,0) 13(6.35,0) 14(8.89,0) 15(11.43,0) 16(13.97,0) 17(16.51,0) 18(19.05,0) 19(21.59,0) 20(24.13,0)
LED-TH_BD3.8-P2.54-RD
  round 1.524 hole 0.9: 1(-1.27,0) 2(1.27,0)
OLED-TH_L27.8-W27.2-P2.54_C9900033791
  round 1.8 hole 1.05: 1(-3.81,0) 2(-1.27,0) 3(1.27,0) 4(3.81,0)
Pad_e32
  round 3.6 hole 3.2: (0,0)
Pad_e33
  round 3.6 hole 3.2: (0,0)
Pad_e34
  round 3.6 hole 3.2: (0,0)
Pad_e35
  round 3.6 hole 3.2: (0,0)
Pad_e176
  round 1.524 hole 1: 1(0,0)
Pad_e307
  round 1 hole 0.8: 1(0,0)
Pad_e325
  round 1 hole 0.8: 1(0,0)
Pad_e343
  round 1 hole 0.8: 1(0,0)
Pad_e344
  round 1 hole 0.8: 2(0,0)
Pad_e388
  round 1 hole 0.8: 1(0,0)
Pad_e389
  round 1 hole 0.8: 2(0,0)
Pad_e390
  round 1 hole 0.8: 3(0,0)
Pad_e410
  round 1 hole 0.8: 1(0,0)
Pad_e492
  round 1 hole 0.8: 1(0,0)
Pad_e502
  round 1 hole 0.8: 1(0,0)
Pad_e604
  round 0.7 hole 0.5: 1(0,0)
Pad_e625
  round 0.7 hole 0.5: 1(0,0)
Pad_e766
  round 0.7 hole 0.5: 1(0,0)
Pad_e1487
  round 0.6 hole 0.4: 1(0,0)
Pad_e1902
  round 0.6 hole 0.4: 1(0,0)
rad-0.1
  round 1.194 hole 0.711: 1(-1.27,0) 2(1.27,0)
RES-TH_BD2.3-L6.5-P10.50-D0.5
  round 1.4 hole 0.7: 1(-5.25,0) 2(5.25,0)
RES-TH_BD2.4-L6.3-P10.30-D0.6
  round 1.524 hole 1: 1(-5.15,0) 2(5.15,0)
RES-TH_BD2.7-L6.2-P10.20-D0.4
  round 1.4 hole 0.8: 1(-5.1,0) 2(5.1,0)
SW-TH_SHOU-HAN_SS12D10G4
  oval 1.7x2.9 hole 1.1x2.3: 1(-4.8,0) 2(0,0) 3(4.8,0)
TO-92-3_L4.8-W3.7-P2.54-L
  rect 1.8x1.8 hole 1: 1(-2.54,0)
  round 1.8 hole 1: 2(0,0) 3(2.54,0)
TO-220-3_L10.2-W4.5-P2.54-L-1
  rect 1.8x1.5 hole 1.2x1: 1(-2.54,0)
  oval 1.8x1.5 hole 1.2x1: 2(0,0) 3(2.54,0)
T接头
  custom 7x4 hole 2x5: 1(0,0)
  custom 7x4 hole 5x2: 2(0,-7)

## Nets
As in the schematic, except:
3.3V: 6050.8 H1.11 NOREF#8.1 NOREF#20.1 OLED1.2 TB1.4 TB6612FNG1.2 U2.20 U3.3
5V: H1.9 N20直流减速电机1.5 NOREF#5.2 NOREF#6.1 NOREF#7.1 NOREF#9.1 NOREF#10.1 NOREF#11.2 NOREF#12.1 NOREF#18.3 Q5.2 R4470.2 TB6612FNG1.1 U2.18 动量轮1.3 舵机1.2 蓝牙1.1 超声波模块1.1
5V1: NOREF#2.1 NOREF#14.1 OUT+1.1 Q1.1 Q5.3 R10k1.2 R100k.2
12V: INT+1.1 NOREF#16.1 R9.2 R4700.2 U5.1 动量轮1.8
12V1: R44700.2 U5.2 接入.2
GND: 5V.1 12V.1 12V1.1 6050.7 C2.1 H1.10 H1.12 INT-1.1 N20直流减速电机1.2 OLED1.1 OUT-1.1 R10.1 R10k3.2 TB1.8 TB6612FNG1.3 TB6612FNG1.8 U2.19 U3.1 U3.2 ZD1.1 动量轮1.7 接入.1 舵机1.3 蓝牙1.2 超声波模块1.4
3: NOREF#3.1 Q1.3 Q5.1 R10k3.1 R100k.1
PA8: NOREF#17.1 U2.5 动量轮1.5
PB13: H1.6 NOREF#4.1 U2.2

Pads without a net: 6050 2 3 4; INT+1 2; INT-1 2; N20直流减速电机1 3 4; OUT+1 2; OUT-1 2; TB1 5 6 7; TB6612FNG1 6 7; U5 3

## Via types
v1: diameter 3.3, hole 3, Top Layer to Bottom Layer, 2 vias
v2: diameter 0.61, hole 0.4, Top Layer to Bottom Layer, 18 vias
v3: diameter 0.7, hole 0.5, Top Layer to Bottom Layer, 2 vias
v4: diameter 0.61, hole 0.305, Top Layer to Bottom Layer, 6 vias

## Routing (per net, layer and track width the routed paths; a pad name or vN(x,y) marks a point on that pad's centre or on a via; arc(x,y) is an arc through that point)
3.3V: length 256.2
  Inner1 w0.5: U3.3 47.36,35.97 46.85,36.48 33.14,36.48 31.74,37.88 31.74,47.28 32.88,48.42 54.5,48.42 54.86,48.77 54.86,51.59 54.35,52.1 4.44,52.1 4.16,51.83 U2.20 ; TB1.4 40.79,20.76 NOREF#8.1 ; NOREF#8.1 37.97,24.92 36.95,25.94 NOREF#20.1 TB6612FNG1.2 25.26,25.81 23.61,25.81 21.96,24.16 14.09,24.16 10.15,28.1 7.48,28.1 7.36,28.23 6050.8 ; NOREF#8.1 37.97,10.32 37.58,9.94 29.71,9.94 28.44,8.67 28.44,2.7 28.09,2.35 19.78,2.35 H1.11
  Inner2 w0.5: v3(45.75,30.51) 45.75,29.59 45.84,29.5 65.52,29.5 65.91,29.12 65.91,7.4 69.08,4.22 69.97,4.22 70.35,3.84 OLED1.2 ; v3(45.75,30.51) 33.65,30.51 32.12,28.99 32.12,26.07 ; v3(45.75,30.51) 46.85,30.51 47.36,31.02 U3.3
5V: length 222.4
  Inner1 w0.8: 舵机1.2 48.51,20.42 47.94,20.99 45.2,20.99 43.52,22.67 NOREF#12.1 ; NOREF#10.1 79.49,33.05 77.02,35.52 NOREF#11.2 ; NOREF#10.1 79.49,17.56 80.26,16.8 动量轮1.3 ; NOREF#10.1 N20直流减速电机1.5 ; 4.94,12.73 5.23,13.01 5.23,28.48 ; 4.94,12.73 4.69,12.99 超声波模块1.1 ; 4.94,12.73 4.82,12.6 4.82,1.81 5.33,1.3 16.38,1.3 16.64,1.57 16.64,2.97 ; NOREF#11.2 66.08,38.21 65.91,38.39 60.82,38.39 56.38,33.94 56.38,32.48 55.81,31.91 NOREF#12.1 ; NOREF#11.2 77.02,41.25 77.59,41.82 83.12,41.82 83.94,42.64 83.94,44.86 Q5.2 ; NOREF#12.1 25.55,31.91 NOREF#6.1 ; 2.91,28.48 5.23,28.48 ; 5.23,28.48 5.25,28.48 5.25,31.29 NOREF#7.1 ; TB6612FNG1.1 25.39,31.44 NOREF#6.1 ; NOREF#6.1 NOREF#7.1 ; U2.18 9.24,46.68 8.57,46.01 3.04,46.01 1.64,44.61 1.64,32.16 2.21,31.6 NOREF#7.1 ; R4470.2 NOREF#9.1
5V1: length 63.2
  Inner1 w0.8: 36.51,45.37 36.51,43.14 37.33,42.32 NOREF#14.1 ; NOREF#14.1 39.39,42.32 39.39,40.14 40.25,39.28 Q1.1 ; NOREF#14.1 39.36,44.12 R100k.2 39.6,45.84 40.4,46.64 56.38,46.64 NOREF#2.1 ; NOREF#2.1 58.03,51.34 ; NOREF#2.1 76.45,48.29 80.64,44.1 Q5.3
12V: length 91.4
  Inner1 w1.2: NOREF#16.1 47.8,11.34 46.6,10.14 46.6,7.42 U5.1 ; NOREF#16.1 55.11,12.86 55.87,13.62 74.44,13.62 ; NOREF#16.1 58.03,11.34 ; 74.44,13.62 79.37,13.62 80.22,12.77 80.22,5.11 81.23,4.1 82.29,4.1 ; 74.44,13.62 74.44,22.36 73.14,23.66 R9.2 ; R4700.2 75.18,32.04 77.34,29.88 77.34,13.88
12V1: length 57.8
  Inner1 w1.2: 接入.2 48.11,1.68 39.7,1.68 38.85,2.53 U5.2 41.9,7.53 43.04,7.53 43.89,8.37 43.89,11.93 45.71,13.75 52.57,13.75 54.47,15.65 69.97,15.65 71.16,16.84 R44700.2
(no net):
  vias: v1(19.04,26.83) v1(19.04,12.1)
1: length 8
  Inner1 w0.5: 26.21,45.63 26.85,44.98 ZD1.2 26.85,38.78 26.21,38.13
2: length 10.4
  Inner1 w0.5: R10k2.1 37.15,37.5 44.7,37.5 45.05,37.85 45.05,39.12 Q1.2
3: length 49.1
  Inner1 w0.5: R100k.1 49.8,42.09 49.65,41.94 48.63,41.94 47.74,41.05 Q1.3 48,39.02 55.75,39.02 56.56,39.84 R10k3.1 56.92,44.45 63.08,44.45 65.14,46.52 NOREF#3.1
  Inner2 w0.5: Q5.1 65.5,49.18 65.14,48.83 NOREF#3.1
4: length 22.2
  Inner1 w0.5: R4470.1 63.37,35.97 64.25,35.08 64.25,30.5 63.75,30 59.81,30 55.36,25.56 5V.2
5: length 8.7
  Inner1 w1.2: 12V1.2 54.47,22.26 58.03,18.7 R44700.1
6: length 19.4
  Inner1 w1.2: R4700.1 58.79,32.04 56.76,30 49.86,30 49.01,29.16 49.01,25.94 48.47,25.4 46.32,25.4
AO1: length 76.2
  Bottom Layer w0.4: N20直流减速电机1.1 80.76,39.28 80.13,38.64 80.13,34.7 79.52,34.1 69.49,34.1 69.21,33.81 69.21,22.89 67.18,20.86 57.65,20.86 56.25,19.46 45.46,19.46 43.11,17.12 36.75,17.12 33.01,20.86 TB6612FNG1.4
AO2: length 68.2
  Bottom Layer w0.4: TB6612FNG1.5 29.71,18.32 32.38,15.65 37.46,15.65 38.6,14.51 57.65,14.51 58.06,14.92 58.06,19.21 58.82,19.97 78.22,19.97 80.38,22.13 80.38,26.18 80.78,26.58 N20直流减速电机1.6
PA0: length 47.4
  Top Layer w0.4: 舵机1.1 45.84,16.42 44.7,16.42 43.81,17.31 43.81,29.12 43.04,29.88 16.88,29.88 14.34,32.42 14.34,34.58
PA1: length 69.8
  Top Layer w0.5: R10.2 60.91,27.97 56.76,27.97 55.49,29.24 52.69,29.24 52.67,29.26 51.71,29.26 51.69,29.24 44.7,29.24 43.43,30.51 43.19,30.51 43.15,30.56 18.87,30.56 16.88,32.55 16.88,34.58
  Inner1 w0.5: v3(61.04,25.86) 61.04,23.91 R9.1 ; v3(61.04,25.86) R10.2 ; v3(61.04,25.86) 73.19,25.86 73.78,26.45 73.78,28.64 74.13,28.99 75.43,28.99 C2.2
PA2: length 24.6
  Bottom Layer w0.4: 2.91,23.4 4,23.4 4.28,23.68 4.28,29.34 4.94,30 5.45,30 8.12,32.67 17.77,32.67 19.42,34.32 U3.14
PA3: length 40.4
  Bottom Layer w0.4: 蓝牙1.4 2.63,20.58 1.99,20.58 1.71,20.86 1.71,30.77 2.66,31.72 2.66,37.29 2.91,37.55 2.91,37.61 3.31,38.01 20.31,38.01 21.96,36.36 U3.13
PA4: length 25.2
  Bottom Layer w0.4: TB1.3 30.47,23.4 29.71,24.16 29.71,30.51 28.95,31.28 27.04,31.28 25.65,32.67 25.65,33.43 U3.12
PA5: length 21.3
  Bottom Layer w0.4: TB1.2 37.08,25.94 36.69,26.32 36.69,26.68 36.17,27.21 31.26,27.21 30.88,27.59 30.88,32.26 30.6,32.55 27.42,32.55 27.04,32.93 27.04,34.58
PA6: length 71.9
  Top Layer w0.4: v4(67.76,19.08) 67.68,19.08 67.05,19.72 67.05,31.66 65.62,33.09 42.57,33.09 40.89,31.4 31.11,31.4 29.58,32.93 U3.10
  Bottom Layer w0.4: v4(67.76,19.08) 69.53,17.31 78.35,17.31 80.26,19.21 80.26,20.48 81.65,21.88 动量轮1.1
PA7: length 71.1
  Top Layer w0.4: U3.9 32.12,36.2 32.79,36.86 56.89,36.86 59.17,34.58 66.41,34.58 68.57,32.42 v4(68.57,17.18)
  Bottom Layer w0.4: v4(68.57,17.18) 69.46,16.29 79.24,16.29 81.02,18.07 81.02,18.63 81.72,19.34 动量轮1.2
PA8: length 80.3
  Top Layer w0.4: U2.5 42.41,50.44 42.41,51.98 42.69,52.26 55.11,52.26 55.39,51.98 55.39,50.17 56.25,49.31 76.95,49.31 78.22,48.04 v2(78.22,44.1) ; v2(79.37,39.15) 79.37,31.53 78.22,30.39 78.22,15.82 NOREF#17.1
  Bottom Layer w0.4: v2(78.22,44.1) 79.37,42.96 v2(79.37,39.15) ; NOREF#17.1 78.6,14 80.89,11.72 动量轮1.5
PA9: length 22.4
  Bottom Layer w0.4: U2.6 39.72,47.81 41,46.53 41,28.59 TB1.1
PA10: length 66.8
  Top Layer w0.4: v2(20.82,32.67) 25.39,32.67 25.77,33.05 25.77,35.59 26.79,36.61 28.69,36.61 29.46,37.37 v2(29.46,38.39)
  Bottom Layer w0.4: U2.7 37.18,48.27 35.68,46.77 31.11,46.77 29.46,45.12 v2(29.46,38.39) ; H1.7 13.83,2.95 12.89,3.9 12.89,6.78 15.33,9.22 15.33,30.99 16.5,32.16 20.31,32.16 v2(20.82,32.67)
PA11: length 59.6
  Top Layer w0.4: U2.8 34.64,48.91 33.65,47.91 28.82,47.91 v4(28.57,47.66)
  Bottom Layer w0.4: v4(28.57,47.66) 28.57,40.29 28.06,39.78 25.01,39.78 23.11,37.88 23.11,35.2 23.22,35.1 23.22,34.06 23.11,33.95 23.11,26.45 19.8,23.15 17.01,23.15 16.25,22.39 16.25,9.05 14.09,6.89 H1.8
PB0: length 58
  Top Layer w0.4: v2(34.16,28.73) 33.39,28.73 30.22,25.56 30.22,24.8 27.68,22.26 27.68,2.06 27.17,1.56 8.71,1.56 8.48,1.78 7.64,1.78 6.47,2.95
  Bottom Layer w0.4: 34.66,34.58 34.66,28.99 34.41,28.73 v2(34.16,28.73)
PB1: length 66.3
  Top Layer w0.4: v2(36.95,28.61) 29.07,20.73 29.07,1.56 28.44,0.92 5.71,0.92 4.82,1.81 4.82,4.99 5.1,5.27 6.24,5.27 6.47,5.49
  Bottom Layer w0.4: 37.2,34.58 37.2,28.86 v2(36.95,28.61)
PB3: length 63.2
  Top Layer w0.4: U2.11 27.02,48.27 26.66,47.91 24.25,47.91 23.97,47.63 23.97,45.91 23.68,45.63 19.71,45.63 v4(19.42,45.34) ; H1.3 10.28,4.22 10.28,6.64 10.67,7.02 12.32,7.02 14.34,9.05 14.34,30.26 13.07,31.53 13.07,37.5 13.83,38.26 18.41,38.26 19.42,39.28 v4(19.42,42.32)
  Bottom Layer w0.4: v4(19.42,45.34) v4(19.42,42.32)
PB4: length 61.5
  Top Layer w0.4: U2.12 23.11,48.91 23.11,47.04 22.71,46.64 18.79,46.64 v2(17.52,45.37) ; H1.4 8.88,5.37 8.75,5.37 8.6,5.52 8.6,7.24 9.39,8.03 11.93,8.03 13.45,9.56 13.45,30 10.52,32.94 10.52,39.39 11.17,40.04 16.95,40.04 17.23,40.32 17.23,41.91 v2(17.52,42.19)
  Bottom Layer w0.4: v2(17.52,45.37) v2(17.52,42.19)
PB5: length 56.1
  Top Layer w0.4: v2(16.38,42.32) 9.64,42.32 7.99,40.67 7.99,33.56 12.06,29.5 12.06,13.62 9.64,11.21 7.99,11.21 6050.1 ; v2(16.38,46.09) 17.82,47.53 21.43,47.53 21.71,47.81 21.71,50.06 U2.13
  Bottom Layer w0.4: v2(16.38,46.09) v2(16.38,42.32)
PB6: length 55.7
  Top Layer w0.4: 6050.6 7.64,22.99 9.08,22.99 9.36,23.27 9.36,29.78 8.4,30.74 2.56,30.74 1.77,31.53 1.77,51.09 3.17,52.48 17.21,52.48 19.4,50.29
PB7: length 54.3
  Top Layer w0.4: U2.15 15.41,51.74 3.31,51.74 2.66,51.09 2.66,33.05 3.04,32.67 7.61,32.67 10.79,29.5 10.79,21.78 9.74,20.73 6050.5
PB8: length 110.8
  Top Layer w0.4: 动量轮1.6 83.84,10.73 83.84,40.77 83.56,41.05 79.49,41.05 75.18,45.37 63.75,45.37 62.22,46.9 35.17,46.9 32.62,44.35 15.24,44.35 14.34,45.25 14.34,50.27 U2.16
PB9: length 99.7
  Top Layer w0.4: 动量轮1.4 77.97,14.26 76.7,15.53 76.7,33.81 73.4,37.12 67.81,37.12 64,40.93 38.36,40.93 35.69,43.59 12.44,43.59 11.78,44.25 U2.17
PB10: length 65.2
  Top Layer w0.4: OLED1.3 72.79,2.54 72.79,3.95 72.39,4.35 67.18,4.35 65.02,6.51 v2(65.02,22.51) ; v4(54.86,35.47) 53.96,36.36 40.13,36.36 39.87,36.1 39.87,34.7 U3.6
  Bottom Layer w0.4: v2(65.02,22.51) 65.02,33.18 64.38,33.81 56.51,33.81 v4(54.86,35.47)
PB11: length 61
  Top Layer w0.4: v2(63.52,22.64) 63.52,11.05 v2(63.87,10.7)
  Bottom Layer w0.4: U3.5 45.2,31.66 46.6,31.66 47.49,30.77 63.11,30.77 63.52,30.36 v2(63.52,22.64) ; OLED1.4 75.43,7.91 73.27,10.07 64.51,10.07 v2(63.87,10.7)
PB12: length 112.8
  Top Layer w0.4: v2(62.22,18.45) 62.22,30.62 62.62,31.02 v2(66.05,31.02)
  Bottom Layer w0.4: U2.1 52.42,42.6 53.84,41.18 64.89,41.18 66.29,39.78 66.29,31.25 v2(66.05,31.02) ; v2(62.22,18.45) 62.22,14.77 60.95,13.5 54.09,13.5 52.57,11.97 33.27,11.97 32.12,10.83 32.12,5.75 31.62,5.24 31.62,2.19 31.23,1.81 19.73,1.81 19.67,1.75 12.75,1.75 H1.5
PB13: length 80.2
  Top Layer w0.4: v2(26.79,4.1) 21.07,4.1 20.95,4.22 12.82,4.22 H1.6 ; U2.2 49.78,50.18 49.78,48.19 49.38,47.78 38.47,47.78 NOREF#4.1 ; v2(30.34,4.1) 30.6,4.35 30.6,19.97 v2(38.22,27.59)
  Bottom Layer w0.4: v2(26.79,4.1) v2(30.34,4.1) ; v2(38.22,27.59) 38.22,33.82 38.46,34.06 38.46,35.1 38.22,35.33 38.22,38.64 38.28,38.7 38.28,47.59 NOREF#4.1
PB14: length 108
  Bottom Layer w0.4: 超声波模块1.2 4.47,8.77 4.47,3.11 4.18,2.83 2.28,2.83 0.5,4.6 0.5,33.18 1.01,33.69 1.01,50.07 3.67,52.74 46.58,52.74 47.34,51.98 U2.3
PB15: length 87.5
  Bottom Layer w0.4: 超声波模块1.3 1.14,9.56 1.14,31.66 1.9,32.42 1.9,37.88 2.53,38.51 2.53,50.58 3.93,51.98 43.12,51.98 U2.4

## Copper pours and planes (outline as drawn; the poured copper is in the pictures)
GND on Top Layer: -3.22,54.52 89.65,54.52 90.03,54.14 90.03,-0.86 86.73,-4.16 65.27,-4.16 62.98,-1.87 62.98,9.67 62.73,9.93 62.09,9.29 62.09,8.16 54.47,8.16 53.71,8.92 49.78,8.92 49.65,8.8 49.16,8.8 49.16,2.05 49.4,1.81 61.97,1.81 62.22,1.56 61.97,1.3 61.97,-2.13 45.97,-2.13 44.82,-0.98 44.82,6.64 44.57,6.89 33.01,6.89 32.88,7.02 32.88,2.19 33.27,1.81 43.64,1.81 43.77,1.68 43.77,-1.4 43.68,-1.49 -2.04,-1.49 -2.29,-1.75 -3.22,-0.81
GND on Bottom Layer: -1.39,54.9 86.61,54.9 87.5,54.01 87.5,0.16 84.96,-2.38 63.37,-2.38 62.48,-1.49 62.48,9.3 62.22,9.56 48.63,9.56 48.25,9.94 48.25,-3.27 48.12,-3.4 46.6,-1.87 45.01,-1.87 44.82,6.89 44.95,7.02 33.52,7.02 33.52,6.08 32.87,5.43 33.02,2.32 42.45,2.32 43.69,-1.75 -2.29,-1.75 -2.29,53.99
GND on Inner2: 55.24,7.27 62.98,7.27 65.4,4.86 65.4,3.97 68.06,3.97 69.08,2.95 69.08,0.86 55.68,0.86 54.86,1.68 54.86,6.89

Small or netless copper shapes (teardrops, artwork), in the pictures only: 50 on Top Layer, 51 on Bottom Layer, 92 on Inner1, 8 on Inner2

## Text on the board
Top Silkscreen Layer: PB0 | PB1 | PB4 | PB3 | PB13 | PB12 | PA11 | PA10 | GND | 5V | 3.3V | OLED1 | 关 | 开
